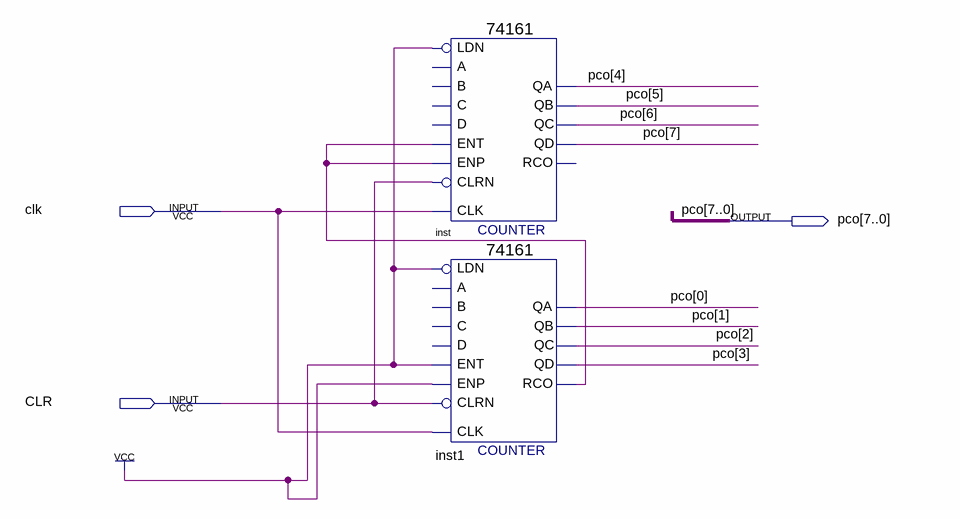
[diagram p0: schematic sheet]
// Quartus schematic pc.bdf as structural Verilog: 2 symbols, 3 pins
module pc (
  input  clk,
  input  CLR,
  output [7:0] pco
);

  wire inst1_rco;

  \74161  inst (
    .CLRN(CLR), .CLK(clk), .ENP(inst1_rco), .LDN(1'b1), .ENT(inst1_rco), .QD(pco[7]), .QC(pco[6]),
    .QB(pco[5]), .QA(pco[4]));  // open: A, D, B, C, RCO
  \74161  inst1 (
    .CLRN(CLR), .CLK(clk), .ENP(1'b1), .LDN(1'b1), .ENT(1'b1), .QD(pco[3]), .QC(pco[2]), .QB(pco[1]),
    .QA(pco[0]), .RCO(inst1_rco));  // open: A, D, B, C
endmodule
